# EAGLE design MainBoard (EAGLE 9.0.1)
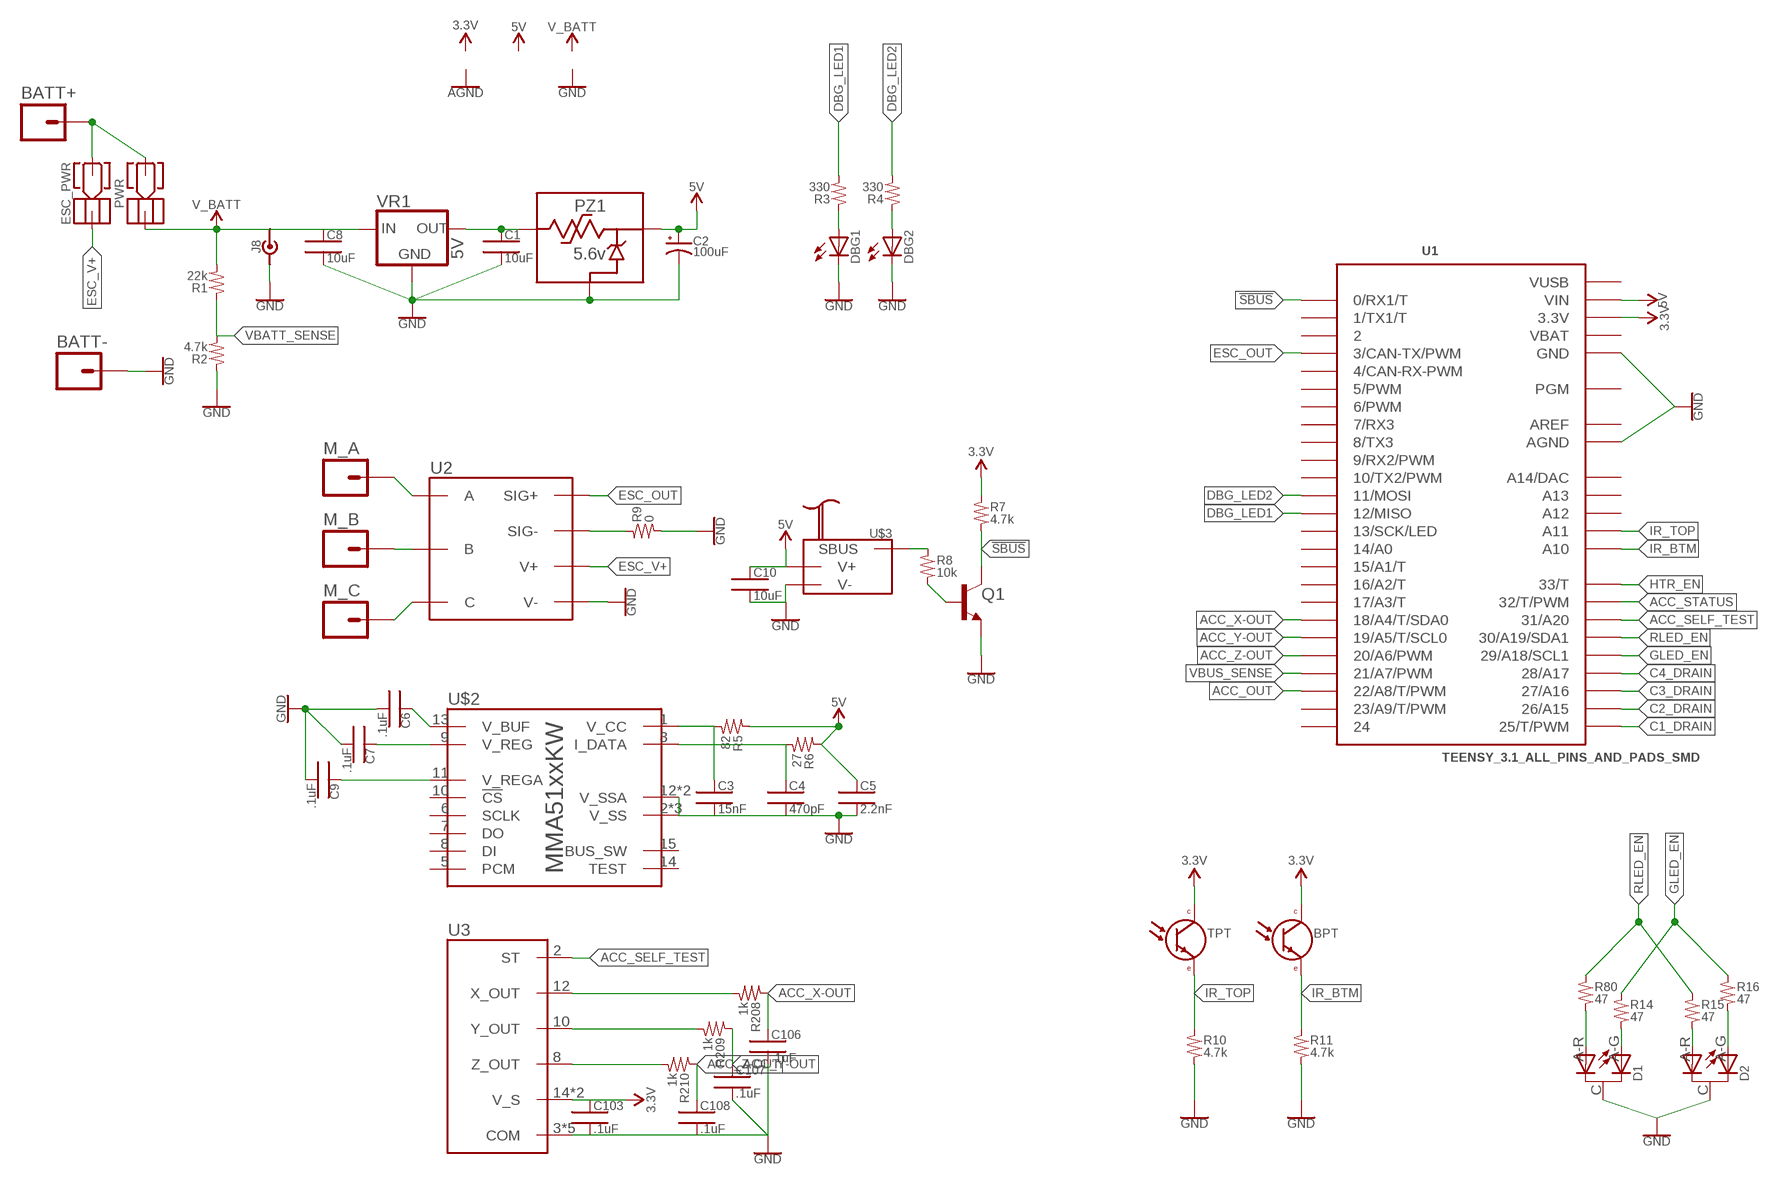
[diagram p0: schematic, sheet 1]

## Parts
BATT+  14AWG_PTH  [14AWG_PTH]
BATT-  14AWG_PTH  [14AWG_PTH]
BPT  PHOTOTRANSISTOR_OPXXX-H  [OP550+_HORIZ]
C1  10uF  CAP_SMD_0805  [0805]
C2  100uF  CAP_POL_SMD  [2917_D-CASE]
C3  15nF  CAP_SMD_0805  [0805]
C4  470pF  CAP_SMD_0805  [0805]
C5  2.2nF  CAP_SMD_0805  [0805]
C6  .1uF  CAP_SMD_0805  [0805]
C7  .1uF  CAP_SMD_0805  [0805]
C8  10uF  CAP_SMD_0805  [0805]
C9  .1uF  CAP_SMD_0805  [0805]
C10  10uF  CAP_SMD_0805  [0805]
C103  .1uF  CAP_SMD_0805  [0805]
C106  .1uF  CAP_SMD_0805  [0805]
C107  .1uF  CAP_SMD_0805  [0805]
C108  .1uF  CAP_SMD_0805  [0805]
D1  TLVS5100  [TLSV5100]
D2  TLVS5100  [TLSV5100]
DBG1  LED1206  [LED-1206]
DBG2  LED1206  [LED-1206]
ESC_PWR  SCREW_SW_M3  [SCREW_SW_M3]
J8  PJ-082BH  [PJ-082BH]
M_A  14AWG_PTH  [14AWG_PTH]
M_B  14AWG_PTH  [14AWG_PTH]
M_C  14AWG_PTH  [14AWG_PTH]
PWR  SCREW_SW_M3  [SCREW_SW_M3]
PZ1  5.6v  POLYZEN_LS  [POLYZEN_LS]
Q1  BJT_NPN  [SOT23-3]
R1  22k  RES_SMD0805  [0805]
R2  4.7k  RES_SMD0805  [0805]
R3  330  RES_SMD0805  [0805]
R4  330  RES_SMD0805  [0805]
R5  82  RES_SMD0805  [0805]
R6  27  RES_SMD0805  [0805]
R7  4.7k  RES_SMD0805  [0805]
R8  10k  RES_SMD0805  [0805]
R9  0  RES_SMD0805  [0805]
R10  4.7k  RES_SMD0805  [0805]
R11  4.7k  RES_SMD0805  [0805]
R14  47  RES_SMD0805  [0805]
R15  47  RES_SMD0805  [0805]
R16  47  RES_SMD0805  [0805]
R80  47  RES_SMD0805  [0805]
R208  1k  RES_SMD0805  [0805]
R209  1k  RES_SMD0805  [0805]
R210  1k  RES_SMD0805  [0805]
TPT  PHOTOTRANSISTOR_OPXXX-H  [OP550+_HORIZ]
U1  TEENSY_3.1_ALL_PINS_AND_PADS_SMD  [TEENSY_3.1_SMD_ALLPINS]
U2  ZTW_30A_BLDCESC  [ZTW_SPIDER_30A_HV_OPTO_ESC]
U3  ADXL326_QFN16  [QFN16]
U$2  MMA51XXKW  [QFN16]
U$3  SBUS_RC_RX_FRSKY-XMPM  [FRSKY_XM_PLUS_MINI]
VR1  5V  TSR_2-XXXX  [TSR_2-XXXX]

## Nets
3.3V: BPT.C C103.1 R7.1 TPT.C U1.3.3V U1.3.3V1(3.3V) U1.3.3V2(3.3V) U3.14(V_S) U3.15(V_S)
5V: C2.A+(+) C5.1 C10.1 PZ1.VOUT(V_OUT) R5.1 R6.1 U1.VIN U$3.5V(V+)
!SBUS: Q1.3(C) R7.2 U1.0(0/RX1/T)
ACC_OUT: U1.22/A8(22/A8/T/PWM)
ACC_SELF_TEST: U1.31(31/A20) U3.2(ST)
ACC_STATUS: U1.32(32/T/PWM)
ACC_X-OUT: C106.1 R208.1 U1.18/A4(18/A4/T/SDA0)
ACC_Y-OUT: C107.1 R209.1 U1.19/A5(19/A5/T/SCL0)
ACC_Z-OUT: C108.1 R210.1 U1.20/A6(20/A6/PWM)
C1_DRAIN: U1.25(25/T/PWM)
C2_DRAIN: U1.26(26/A15)
C3_DRAIN: U1.27(27/A16)
C4_DRAIN: U1.28(28/A17)
DBG_LED1: R3.2 U1.12(12/MISO)
DBG_LED2: R4.2 U1.11(11/MOSI)
ESC_OUT: U1.3(3/CAN-TX/PWM) U2.S+(SIG+)
ESC_V+: ESC_PWR.BLK U2.V0+(V+) U2.V1+(V+) U2.V2+(V+) U2.V3+(V+) U2.V4+(V+)
GLED_EN: R14.1 R16.1 U1.29(29/A18/SCL1)
GND: BATT-.P C1.2 C2.C-(-) C3.2 C4.2 C5.2 C6.2 C7.2 C8.2 C9.2 C10.2 C103.2 C106.2 C107.2 C108.2 D1.C D2.C DBG1.C DBG2.C J8.2 J8.SH1 J8.SH2 J8.SH3 J8.SH4 PZ1.GND Q1.2(E) R2.1 R9.2 R10.2 R11.2 U1.AGND U1.GND U1.GND1(GND) U1.GND2(GND) U2.V0-(V-) U2.V1-(V-) U2.V2-(V-) U2.V3-(V-) U2.V4-(V-) U3.3(COM) U3.5(COM) U3.6(COM) U3.7(COM) U3.17(COM) U$2.2(V_SS) U$2.4(V_SS) U$2.12(V_SSA) U$2.16(V_SSA) U$2.17(V_SS) U$3.GND(V-) VR1.2(GND)
HTR_EN: U1.33(33/T)
IR_BTM: BPT.E R11.1 U1.A10
IR_TOP: R10.1 TPT.E U1.A11
N$1: M_A.P U2.A0(A) U2.A1(A) U2.A2(A) U2.A3(A) U2.A4(A)
N$2: M_B.P U2.B0(B) U2.B1(B) U2.B2(B) U2.B3(B) U2.B4(B)
N$3: M_C.P U2.C0(C) U2.C1(C) U2.C2(C) U2.C3(C) U2.C4(C)
N$4: C9.1 U$2.11(V_REGA)
N$5: C7.1 U$2.9(V_REG)
N$6: C6.1 U$2.13(V_BUF)
N$7: R8.1 U$3.SBUS
N$8: C3.1 R5.2 U$2.1(V_CC)
N$9: C4.1 R6.2 U$2.3(I_DATA)
N$10: R9.1 U2.S-(SIG-)
N$11: Q1.1(B) R8.2
N$12: BATT+.P ESC_PWR.BLT PWR.BLT
N$13: D1.A-R(A1) R80.2
N$14: D1.A-G(A2) R14.2
N$15: D2.A-R(A1) R15.2
N$16: D2.A-G(A2) R16.2
N$34: R208.2 U3.12(X_OUT)
N$35: R209.2 U3.10(Y_OUT)
N$36: R210.2 U3.8(Z_OUT)
N$48: DBG2.A R4.1
N$49: DBG1.A R3.1
N$50: C1.1 PZ1.VIN(V_IN) VR1.3(OUT)
RLED_EN: R15.1 R80.1 U1.30(30/A19/SDA1)
V_BATT: C8.1 J8.1 PWR.BLK R1.2 VR1.1(IN)
VBATT_SENSE: R1.1 R2.2
VBUS_SENSE: U1.21/A7(21/A7/PWM)
Unconnected: U1.1(1/TX1/T) U1.2 U1.4(4/CAN-RX-PWM) U1.5(5/PWM) U1.6(6/PWM) U1.7(7/RX3) U1.8(8/TX3) U1.9(9/RX2/PWM) U1.10(10/TX2/PWM) U1.13(13/SCK/LED) U1.14/A0 U1.15/A1(15/A1/T) U1.16/A2(16/A2/T) U1.17/A3(17/A3/T) U1.23/A9(23/A9/T/PWM) U1.24 U1.A12 U1.A13 U1.A14(A14/DAC) U1.PGM U$2.5(PCM) U$2.6(SCLK) U$2.7(DO) U$2.8(DI) U$2.10(!CS) U$2.14(TEST) U$2.15(BUS_SW)

## Power pins joined to a net without a drawn wire
AREF: U1.AREF
VBAT: U1.VBAT
VUSB: U1.VUSB

## Library data of the parts
BATT+ BATT- M_A M_B M_C = meltylib:14AWG
BPT TPT = meltylib:PHOTOTRANSISTOR
C1 C3-C10 C103 C106-C108 = meltylib:CAP_SMD
C2 = meltylib:CAP_POL_SMD
D1 D2 = meltylib:TLVS5100
DBG1 DBG2 = jack_led:LED
ESC_PWR PWR = meltylib:SCREW_SW
J8 = meltylib:PJ-082BH: 2.5mm X 5.5mm Barrel Jack 10A https://www.mouser.com/productdetail/cui/pj-082bh?qs=sGAEpiMZZMtnOp%252bbbqA009lE0K0K%252bPZGlcfi0IIywdBXw6pUdVh2jw%3D%3D
PZ1 = meltylib:POLYZEN: https://www.mouser.com/ds/2/240/Littelfuse_PolyZen_Standard_PolyZen_Catalog_Datash-1021770.pdf
Q1 = meltylib:BJT_NPN
R1-R11 R14-R16 R80 R208-R210 = meltylib:RES_SMD
U1 = meltylib:TEENSY_3.1_ALL_PINS_AND_PADS: Footprint for Teensy 3.1 board using all pads and all through-holes. Pads need a 2x7 0.1" SMD header.
U2 = meltylib:ZTW_30A_BLDCESC
U3 = meltylib:ADXL326
U$2 = jack_IC:MMA51XXKW
U$3 = meltylib:SBUS_RC_RX
VR1 = meltylib:TSR_2-XXXX: TRACO Power 2A step down converter http://www.mouser.com/ds/2/687/tsr2-datasheet-911338.pdf

## Board
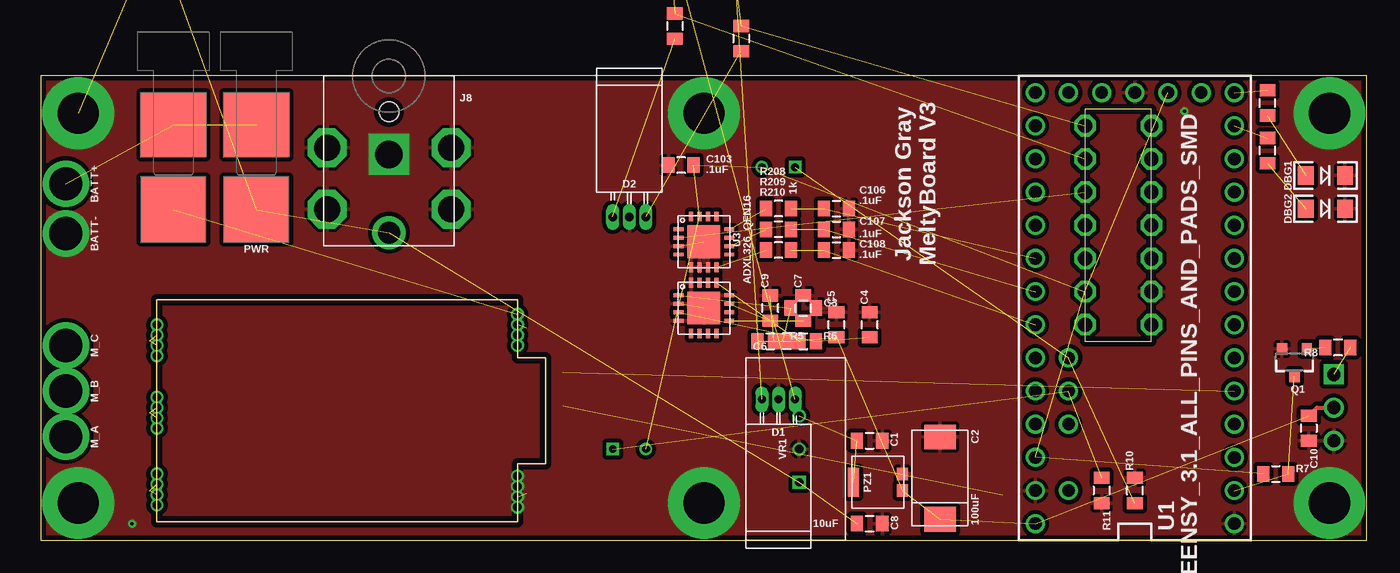
[diagram p1: board, top side]
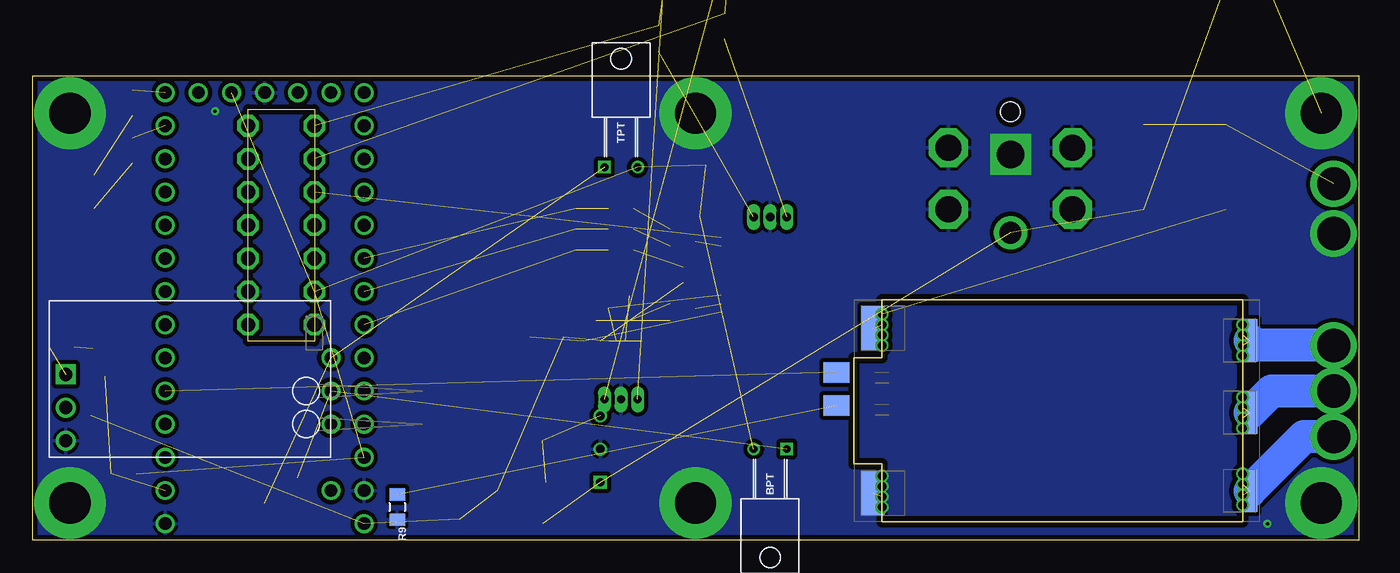
[diagram p2: board, bottom side, seen from below]

Size 101.6 x 35.56 mm. Coordinates in mm from the lower left corner, seen from the top.
Outline: 0,0 101.6,0 101.6,35.56 0,35.56 0,0
Copper layers (1*16): Top 0.0356mm / dielectric 1.5011mm / Bottom 0.0356mm
Design rules "oshpark-2layer *": minimum track width 6mil, minimum drill 10mil, track to track 6mil, track to pad 6mil, pad to pad 6mil, via to via 6mil, smd to smd 6mil, copper to edge 15mil, drill to drill 6mil, minimum pad ring 7mil, minimum via ring 7mil, stop-mask expansion 2.5mil, vias tented up to drill 11mil, thermal gap 10mil

### Footprints (pad centres in the part's own frame; a part is rotated, then mirrored left to right if it is on the bottom)
14AWG_PTH = drill 2.54: P 0,0
OP550+_HORIZ = drill 0.6: C 1.27,0 | drill 0.6 square: E -1.27,0
0805 = smd 0.927 x 1.2: 1 -0.964,0; 2 0.964,0
2917_D-CASE = smd 1.905 x 2.388: A+ -3.15,0; C- 3.15,0
TLSV5100 = drill 0.635 pad 0.813 long: A-G 1.27,0; A-R -1.27,0; C 0,0
LED-1206 = smd 1.2 x 1.4: A -1.5,0; C 1.5,0
SCREW_SW_M3 = smd 5 x 5: BLK 0,-3.25; BLT 0,3.25
PJ-082BH = drill 1.7: 1 12,0 | drill 2.1 square: 2 6,0 | drill 2 octagon: SH1 5.5,4.75; SH2 10.2,4.75; SH3 5.5,-4.75; SH4 10.2,-4.75 | hole 1.5: 2.75,0
POLYZEN_LS = smd 0.86 x 0.94: GND 1.87,0.635; VOUT 1.87,-0.635 | smd 0.86 x 2.21: VIN -1.87,0
SOT23-3 = smd 0.8 x 0.9: 1 -0.95,-1; 2 0.95,-1; 3 0,1.1
TEENSY_3.1_SMD_ALLPINS = drill 0.965: 0 -7.62,15.24; 1 -7.62,12.7; 2 -7.62,10.16; 3 -7.62,7.62; 3.3V 7.62,12.7; 3.3V1 -2.54,-15.24; 4 -7.62,5.08; 5 -7.62,2.54; 6 -7.62,0; 7 -7.62,-2.54; 8 -7.62,-5.08; 9 -7.62,-7.62; 10 -7.62,-10.16; 11 -7.62,-12.7; 12 -7.62,-15.24; 13 7.62,-15.24; 14/A0 7.62,-12.7; 15/A1 7.62,-10.16; 16/A2 7.62,-7.62; 17/A3 7.62,-5.08; 18/A4 7.62,-2.54; 19/A5 7.62,0; 20/A6 7.62,2.54; 21/A7 7.62,5.08; 22/A8 7.62,7.62; 23/A9 7.62,10.16; A10 5.08,7.62; A11 5.08,5.08; A14 5.08,-15.24; AGND 7.62,15.24; AREF 5.08,10.16; GND -7.62,17.78; GND1 0,-15.24; PGM 2.54,-15.24; VBAT -5.08,-15.24; VIN 7.62,17.78; VUSB 5.08,15.24 | drill 1.1 octagon: 3.3V2 3.81,0; 24 -1.27,-2.54; 25 -1.27,-5.08; 26 -1.27,-7.62; 27 -1.27,-10.16; 28 -1.27,-12.7; 29 3.81,-12.7; 30 3.81,-10.16; 31 3.81,-7.62; 32 3.81,-5.08; 33 3.81,-2.54; A12 -1.27,2.54; A13 3.81,2.54; GND2 -1.27,0
ZTW_SPIDER_30A_HV_OPTO_ESC = smd 1.143 x 3.239: A0 0.711,14.628; B0 0.711,8.631; C0 0.711,3.119 | drill 0.635: A1 1.27,15.716; A2 1.27,14.922; A3 1.27,14.129; A4 1.27,13.335; B1 1.27,9.842; B2 1.27,9.049; B3 1.27,8.255; B4 1.27,7.461; C1 1.27,4.286; C2 1.27,3.493; C3 1.27,2.699; C4 1.27,1.905; V1+ 28.892,3.493; V1- 28.892,15.875; V2+ 28.892,2.699; V2- 28.892,15.081; V3+ 28.892,1.905; V3- 28.892,14.287; V4+ 28.892,1.111; V4- 28.892,13.494 | smd 1.981 x 1.575: S+ 32.385,5.556; S- 32.385,8.096 | smd 1.778 x 3.365: V0+ 29.591,2.177; V0- 29.591,14.823
QFN16 = smd 0.75 x 0.3: 1 -1.945,0.975; 2 -1.945,0.325; 3 -1.945,-0.325; 4 -1.945,-0.975; 9 1.945,-0.975; 10 1.945,-0.325; 11 1.945,0.325; 12 1.945,0.975 | smd 0.3 x 0.75: 5 -0.975,-1.945; 6 -0.325,-1.945; 7 0.325,-1.945; 8 0.975,-1.945; 13 0.975,1.945; 14 0.325,1.945; 15 -0.325,1.945; 16 -0.975,1.945 | smd 2.5 x 2.5: 17 0,0
FRSKY_XM_PLUS_MINI = drill 1.016: 5V 1.27,3.81; GND 1.27,1.27 | drill 1.016 square: SBUS 1.27,6.35
TSR_2-XXXX = drill 0.645 square: 1 -2.54,0 | drill 0.645: 2 0,0; 3 2.54,0

### Placement (x,y rotation side)
BATT+  1.91,27.3 270 top
BATT-  1.91,23.5 270 top
BPT  45.09,6.99 180 bottom
C1  63.5,7.62 0 top
C2  68.9,4.76 90 top
C3  58.42,17.78 0 top
C4  63.5,16.51 90 top
C5  60.96,16.51 90 top
C6  57.15,15.24 180 top
C7  58.42,17.78 90 top
C8  63.5,1.27 0 top
C9  55.88,17.78 90 top
C10  97.16,8.57 270 top
C103  49.05,28.73 180 top
C106  60.96,25.4 0 top
C107  60.96,23.81 0 top
C108  60.96,22.23 0 top
D1  56.52,10.79 180 top
D2  45.09,24.77 0 top
DBG1  98.42,27.94 0 top
DBG2  98.42,25.4 0 top
ESC_PWR  10.16,28.57 0 top
J8  26.67,35.56 270 top
M_A  1.91,7.94 270 top
M_B  1.91,11.43 270 top
M_C  1.91,14.92 270 top
PWR  16.51,28.57 0 top
PZ1  64.14,4.45 0 top
Q1  96.04,13.65 180 top
R1  10.16,45.4 0 bottom  (outside the outline)
R2  10.16,47.62 180 bottom  (outside the outline)
R3  93.98,33.5 90 top
R4  93.98,29.84 90 top
R5  55.88,15.24 0 top
R6  58.42,15.24 0 top
R7  94.61,5.08 0 top
R8  99.38,14.76 180 top
R9  73.66,2.54 270 bottom
R10  83.82,3.81 90 top
R11  81.28,3.81 270 top
R14  53.02,45.07 90 top  (outside the outline)
R15  48.58,39.38 270 top
R16  53.66,38.43 270 top
R80  48.26,45.07 90 top  (outside the outline)
R208  56.52,25.4 180 top
R209  56.52,23.81 180 top
R210  56.52,22.23 180 top
TPT  56.52,28.57 0 bottom
U1  83.82,19.05 180 top
U2  7.62,18.41 180 bottom
U3  50.8,22.86 0 top
U$2  50.8,17.78 0 top
U$3  100.33,6.35 0 bottom
VR1  58.1,6.99 90 top

### Tracks (layer width: path | path; a pad name or v marks a point on that pad's centre or on a via)
3.3V  (7 unrouted)
  Top 0.159: U3.14 U3.15
5V  (6 unrouted)
  Top 0.318: C10.1 97.78,10.16 U$3.5V
!SBUS  (2 unrouted)
ACC_SELF_TEST  (1 unrouted)
ACC_X-OUT  (2 unrouted)
ACC_Y-OUT  (2 unrouted)
ACC_Z-OUT  (2 unrouted)
DBG_LED1  (1 unrouted)
DBG_LED2  (1 unrouted)
ESC_OUT  (1 unrouted)
ESC_V+  (5 unrouted)
GLED_EN  (2 unrouted)
GND  (via drill 0.25, 3.15 pad 5.5)  (8 unrouted)
  other vias: 2.86,32.7 2.86,2.86 50.8,32.7 50.8,2.86 98.74,2.86 98.74,32.7 87.63,32.86 6.99,1.27
  pour Bottom (isolate 0.318): -5.08,-5.08 -5.08,40.64 106.68,40.64 106.68,-5.08
  pour Top (isolate 0.318): -2.54,-2.54 -2.54,38.1 104.14,38.1 104.14,-2.54
IR_BTM  (2 unrouted)
IR_TOP  (2 unrouted)
N$1  (4 unrouted)
  Bottom 2.54: M_A.P 4.18,7.94 U2.A0
N$2  (4 unrouted)
  Bottom 2.54: M_B.P 6.68,11.43 U2.B0
N$3  (4 unrouted)
  Bottom 2.54: M_C.P 7.96,14.92 U2.C0
N$4  (1 unrouted)
N$5  (1 unrouted)
N$6  (1 unrouted)
N$7  (1 unrouted)
N$8  (2 unrouted)
N$9  (2 unrouted)
N$10  (1 unrouted)
N$11  (1 unrouted)
N$12  (2 unrouted)
N$13  (1 unrouted)
N$14  (1 unrouted)
N$15  (1 unrouted)
N$16  (1 unrouted)
N$34  (1 unrouted)
N$35  (1 unrouted)
N$36  (1 unrouted)
N$48  (1 unrouted)
N$49  (1 unrouted)
N$50  (2 unrouted)
RLED_EN  (2 unrouted)
V_BATT  (4 unrouted)
VBATT_SENSE  (1 unrouted)

### Text on the board
tPlace: Jackson Gray / MeltyBoard V3